# Altium schematic sheet ArduinoMega.SchDoc
size 209 x 148 mm
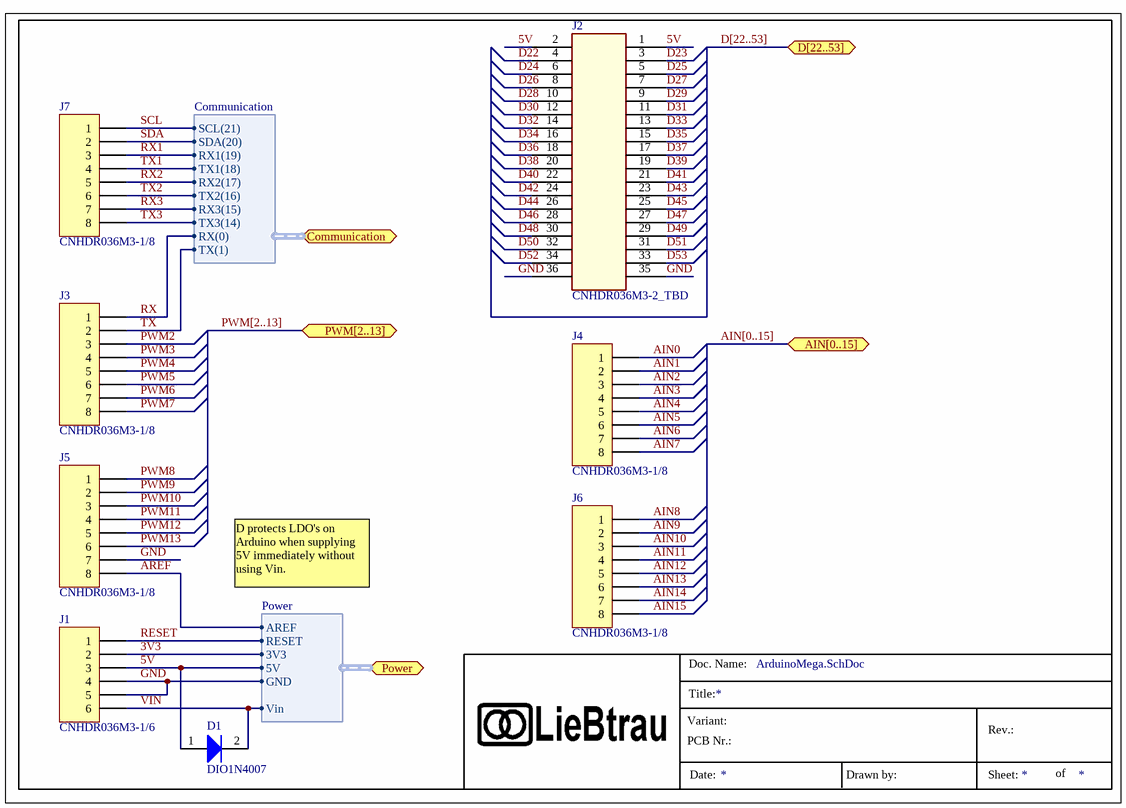
[diagram p0: ArduinoMega.SchDoc]

## Parts
D1  DIO1N4007  [DO-41]
J1  CNHDR036M3-1/6  [J_HDR1X6]
J2  CNHDR036M3-2_TBD  [J_HDR2X18]
J3  CNHDR036M3-1/8  [J_HDR1X8]
J4  CNHDR036M3-1/8  [J_HDR1X8]
J5  CNHDR036M3-1/8  [J_HDR1X8]
J6  CNHDR036M3-1/8  [J_HDR1X8]
J7  CNHDR036M3-1/8  [J_HDR1X8]

## Ports
AIN[0..15], Communication (harness Communication), D[22..53], Power (harness Power), PWM[2..13]

## Harnesses
Power: RESET, 3V3, 5V, GND, Vin, AREF
Communication: RX(0), TX(1), TX3(14), RX3(15), TX2(16), RX2(17), TX1(18), RX1(19), SDA(20), SCL(21)

## Nets
3V3: J1.2 ; port Power.3V3
5V: D1.1(A) J1.3 J2.1 J2.2 ; port Power.5V
AIN0: J4.1
AIN1: J4.2
AIN2: J4.3
AIN3: J4.4
AIN4: J4.5
AIN5: J4.6
AIN6: J4.7
AIN7: J4.8
AIN8: J6.1
AIN9: J6.2
AIN10: J6.3
AIN11: J6.4
AIN12: J6.5
AIN13: J6.6
AIN14: J6.7
AIN15: J6.8
AREF: J5.8 ; port Power.AREF
D22: J2.4
D23: J2.3
D24: J2.6
D25: J2.5
D26: J2.8
D27: J2.7
D28: J2.10
D29: J2.9
D30: J2.12
D31: J2.11
D32: J2.14
D33: J2.13
D34: J2.16
D35: J2.15
D36: J2.18
D37: J2.17
D38: J2.20
D39: J2.19
D40: J2.22
D41: J2.21
D42: J2.24
D43: J2.23
D44: J2.26
D45: J2.25
D46: J2.28
D47: J2.27
D48: J2.30
D49: J2.29
D50: J2.32
D51: J2.31
D52: J2.34
D53: J2.33
GND: J1.4 J1.5 J2.35 J2.36 J5.7 ; port Power.GND
PWM2: J3.3
PWM3: J3.4
PWM4: J3.5
PWM5: J3.6
PWM6: J3.7
PWM7: J3.8
PWM8: J5.1
PWM9: J5.2
PWM10: J5.3
PWM11: J5.4
PWM12: J5.5
PWM13: J5.6
RESET: J1.1 ; port Power.RESET
RX: J3.1 ; port Communication.RX(0)
RX1: J7.3 ; port Communication.RX1(19)
RX2: J7.5 ; port Communication.RX2(17)
RX3: J7.7 ; port Communication.RX3(15)
SCL: J7.1 ; port Communication.SCL(21)
SDA: J7.2 ; port Communication.SDA(20)
TX: J3.2 ; port Communication.TX(1)
TX1: J7.4 ; port Communication.TX1(18)
TX2: J7.6 ; port Communication.TX2(16)
TX3: J7.8 ; port Communication.TX3(14)
VIN: D1.2(K) J1.6 ; port Power.Vin

## Buses and harness runs
bus AIN[0..15] = port AIN[0..15]
bus D[22..53] = port D[22..53]
bus PWM[2..13] = port PWM[2..13]

## Notes on the sheet
- D protects LDO's on Arduino when supplying 5V immediately without using Vin.
- Title:
- Doc. Name:
- Variant:
- PCB Nr.:
- Rev.:
- Date:
- Drawn by:
- Sheet:
- of

## Library data of the parts
D1 = DIO1N4007: 1 Amp General Purpose Rectifier; Part Number: DIO1N4007
J1 = CNHDR036M3-1/6: *; Order Code: RS: 673-7474; Part Number: CNHDR036M3-1/6
J2 = CNHDR036M3-2_TBD: Order Code: RS: 670-3562; Part Number: CNHDR036M3-2_TBD
J3-J7 = CNHDR036M3-1/8: *; Order Code: RS: 673-7483; Part Number: CNHDR036M3-1/8